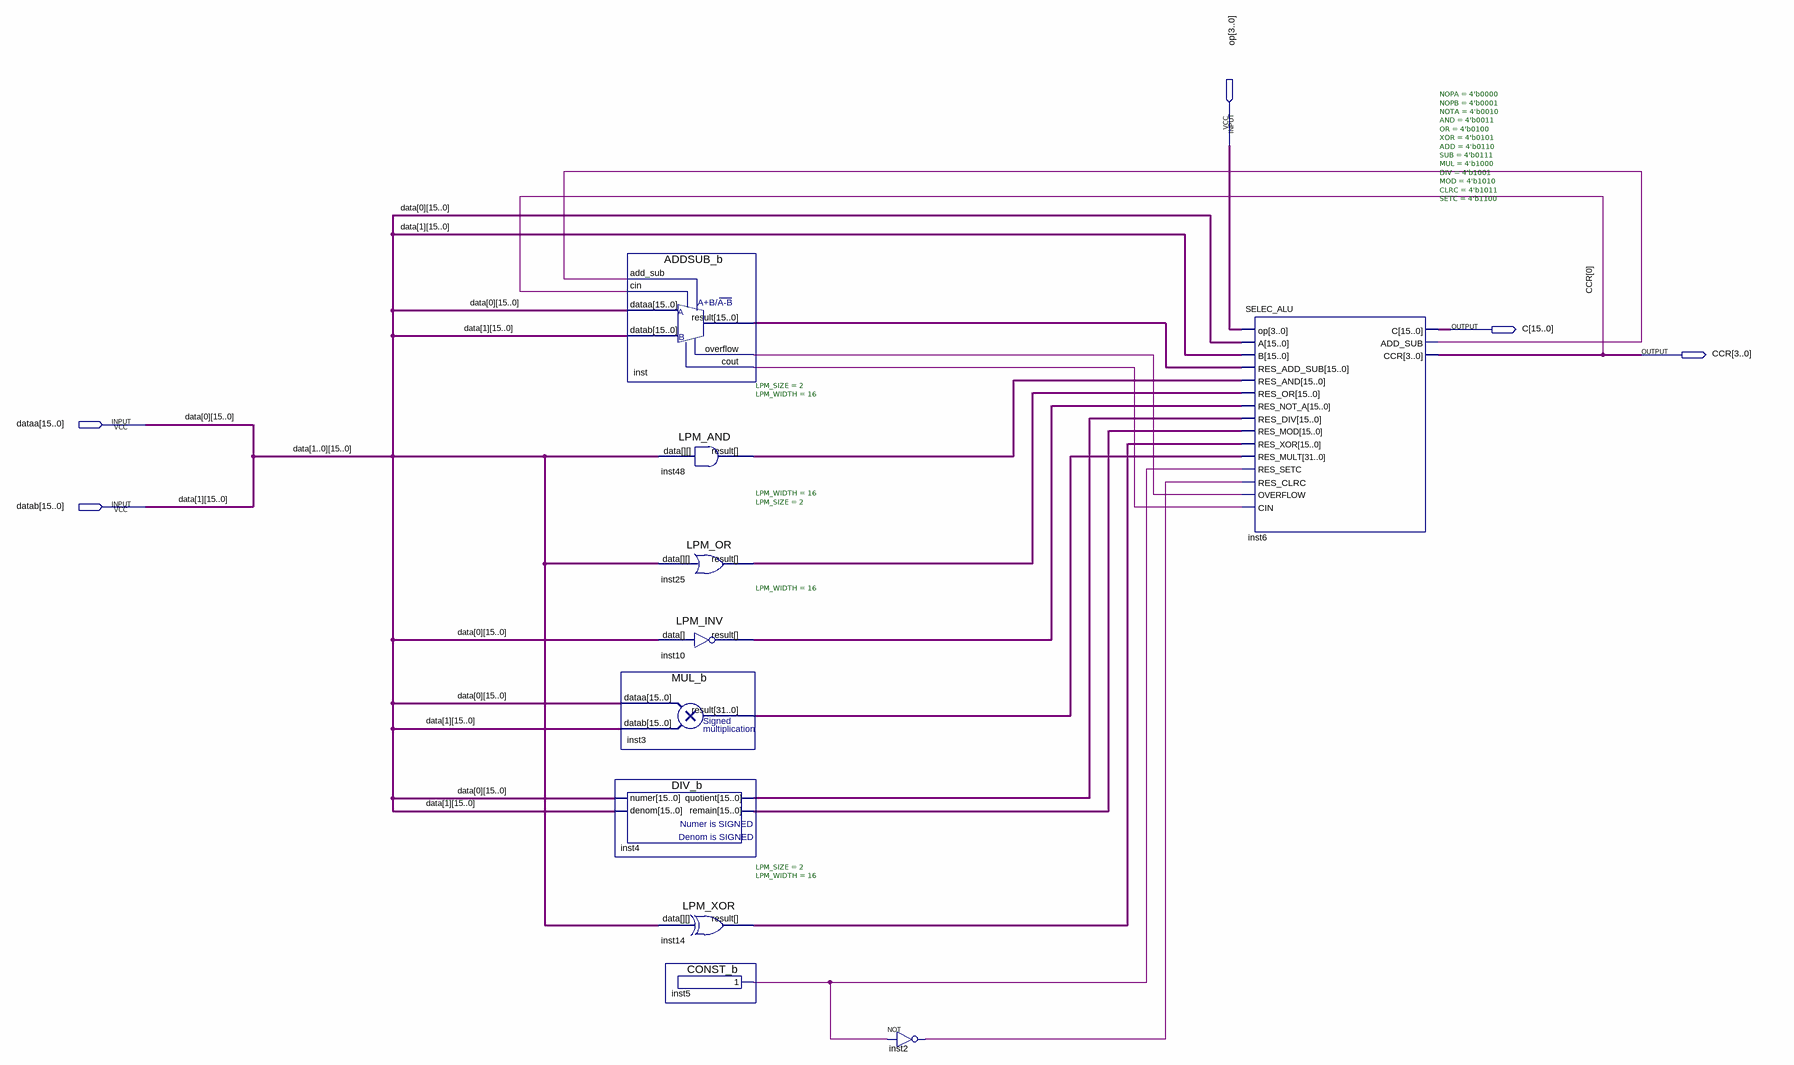
[diagram p0: schematic sheet]
// Quartus schematic ALU.bdf as structural Verilog: 10 symbols, 5 pins
module ALU (
  input  [3:0] op,
  input  [15:0] dataa,
  input  [15:0] datab,
  output [15:0] C,
  output [3:0] CCR
);

  wire inst2_out, inst5_result, inst6_add_sub, inst_cout, inst_overflow;
  wire [15:0] inst4_quotient, inst4_remain, inst10_result, inst14_result, inst25_result, inst48_result,
       inst_result;
  wire [31:0] inst3_result;

  ADDSUB_b inst (
    .cin(CCR[0]), .add_sub(inst6_add_sub), .dataa(dataa), .datab(datab), .result(inst_result),
    .overflow(inst_overflow), .cout(inst_cout));
  MUL_b inst3 (.dataa(dataa), .datab(datab), .result(inst3_result));
  DIV_b inst4 (.numer(dataa), .denom(datab), .quotient(inst4_quotient), .remain(inst4_remain));
  LPM_AND #(.LPM_SIZE(2), .LPM_WIDTH(16)) inst48 (.data({datab, dataa}), .result(inst48_result));
  LPM_OR #(.LPM_WIDTH(16), .LPM_SIZE(2)) inst25 (.data({datab, dataa}), .result(inst25_result));
  LPM_INV #(.LPM_WIDTH(16)) inst10 (.data(dataa), .result(inst10_result));
  LPM_XOR #(.LPM_SIZE(2), .LPM_WIDTH(16)) inst14 (.data({datab, dataa}), .result(inst14_result));
  CONST_b inst5 (.result(inst5_result));
  not inst2 (inst2_out, inst5_result);
  SELEC_ALU #(.NOPA(4'b0000), .NOPB(4'b0001), .NOTA(4'b0010), .AND(4'b0011), .OR(4'b0100), .XOR(4'b0101), .ADD(4'b0110), .SUB(4'b0111), .MUL(4'b1000), .DIV(4'b1001), .MOD(4'b1010), .CLRC(4'b1011), .SETC(4'b1100)) inst6 (
    .op(op), .A(dataa), .B(datab), .RES_ADD_SUB(inst_result), .RES_AND(inst48_result),
    .RES_OR(inst25_result), .RES_NOT_A(inst10_result), .RES_DIV(inst4_quotient), .RES_MOD(inst4_remain),
    .RES_XOR(inst14_result), .RES_MULT(inst3_result), .RES_SETC(inst5_result), .RES_CLRC(inst2_out),
    .OVERFLOW(inst_overflow), .CIN(inst_cout), .C(C), .ADD_SUB(inst6_add_sub), .CCR(CCR));

  // Other names for the same wires on the sheet: data_0[15:0] = dataa; data_1[15:0] = datab
endmodule
